# Altium schematic sheet Sheet1.SchDoc
size A4
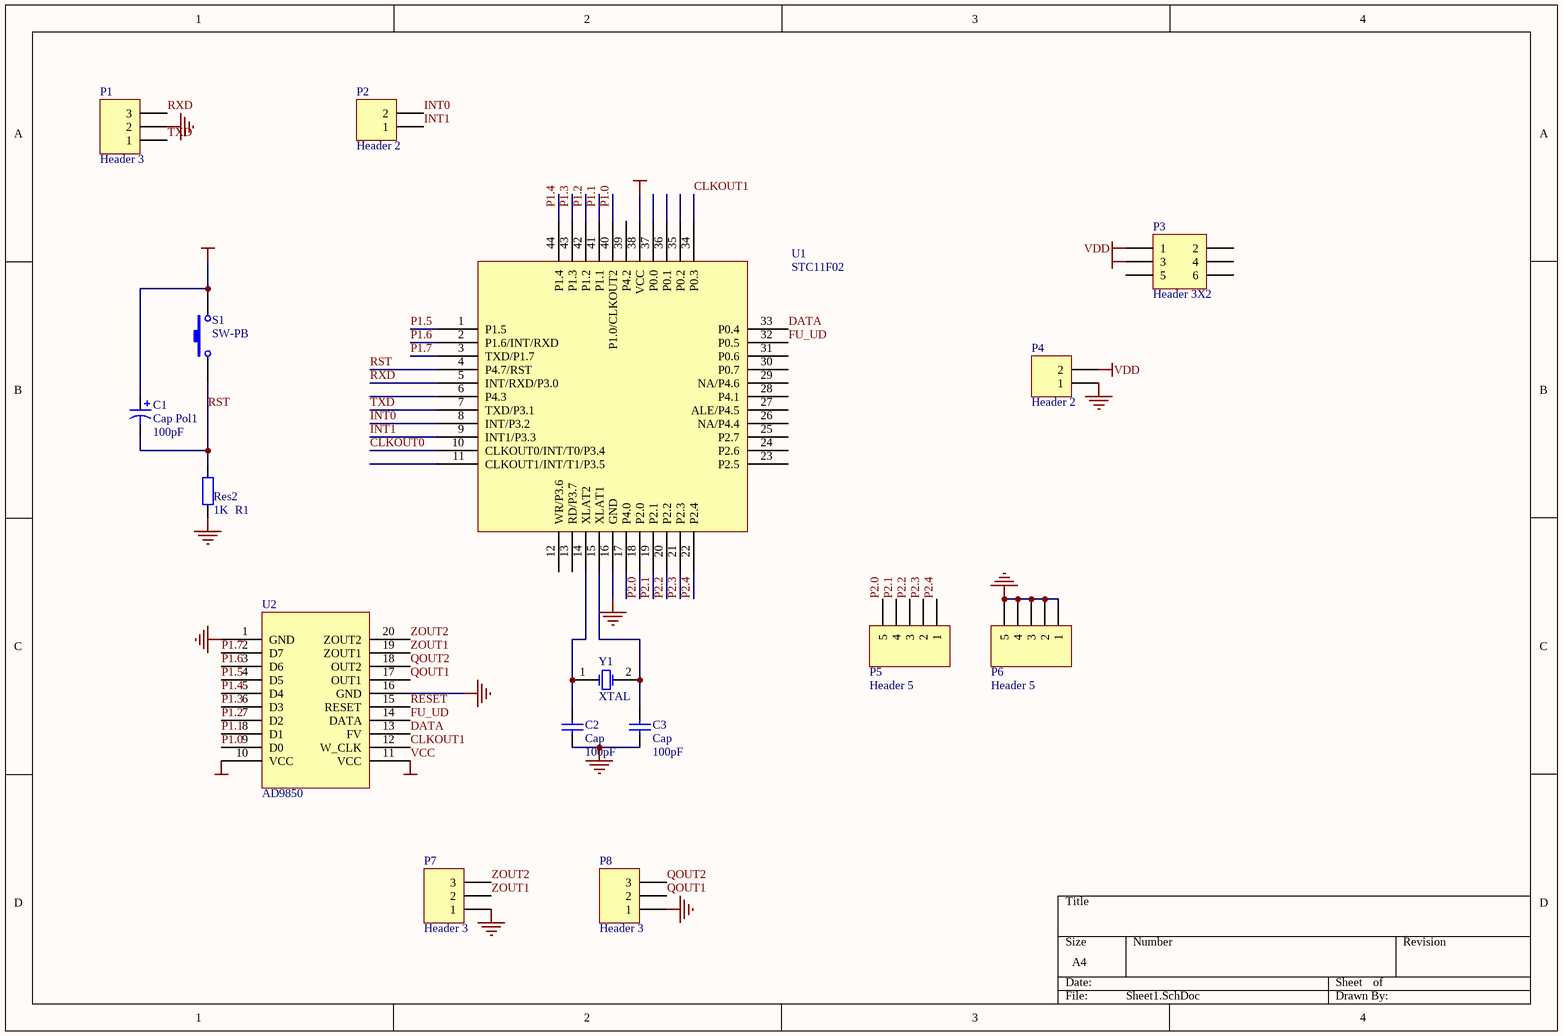
[diagram p0: Sheet1.SchDoc]

## Parts
C1  Cap Pol1  value 100pF  [3.5X2.8X1.9]
C2  Cap  value 100pF  [2012[0805]]
C3  Cap  value 100pF  [6-0805]
P1  Header 3  [HDR1X3]
P2  Header 2  [HDR1X2]
P3  Header 3X2  [KZ]
P4  Header 2  [HDR1X2]
P5  Header 5  [HDR1X5]
P6  Header 5  [HDR1X5]
P7  Header 3  [HDR1X3]
P8  Header 3  [HDR1X3]
R1  Res2  value 1K  [6-0805]
S1  SW-PB  [按键]
U1  STC11F02  [LQLPF44]
U2  AD9850  [ADMK]
Y1  XTAL  [XTAL-200mil]

## Nets
GND: C2.1 C3.1 P1.2 P4.1 P6.1 P6.2 P6.3 P6.4 P6.5 P7.1 P8.1 R1.1 U1.16(GND) U2.1(GND) U2.16(GND)
VCC: C1.1 P3.3 S1.2 U1.38(VCC) U2.10(VCC) U2.11(VCC)  [also labelled +5]
VDD: P3.1 P4.2
CLKOUT0: U1.10(CLKOUT0/INT/T0/P3.4)
CLKOUT1: U1.34(P0.3) U2.12(W_CLK)
DATA: U1.33(P0.4) U2.13(FV)
FU_UD: U1.32(P0.5) U2.14(DATA)
INT0: P2.2 U1.8(INT/P3.2)
INT1: P2.1 U1.9(INT1/P3.3)
P1.0: U1.40(P1.0/CLKOUT2) U2.9(D0)
P1.1: U1.41(P1.1) U2.8(D1)
P1.2: U1.42(P1.2) U2.7(D2)
P1.3: U1.43(P1.3) U2.6(D3)
P1.4: U1.44(P1.4) U2.5(D4)
P1.5: U1.1(P1.5) U2.4(D5)
P1.6: U1.2(P1.6/INT/RXD) U2.3(D6)
P1.7: U1.3(TXD/P1.7) U2.2(D7)
P2.0: P5.5 U1.18(P2.0)
P2.1: P5.4 U1.19(P2.1)
P2.2: P5.3 U1.20(P2.2)
P2.3: P5.2 U1.21(P2.3)
P2.4: P5.1 U1.22(P2.4)
QOUT1: P8.2 U2.17(OUT1)
QOUT2: P8.3 U2.18(OUT2)
RESET: U2.15(RESET)
RST: C1.2 R1.2 S1.1 U1.4(P4.7/RST)
RXD: P1.3 U1.5(INT/RXD/P3.0)
TXD: P1.1 U1.7(TXD/P3.1)
ZOUT1: P7.2 U2.19(ZOUT1)
ZOUT2: P7.3 U2.20(ZOUT2)
NetC2_2: C2.2 U1.14(XLAT2) Y1.1(OSC1)
NetC3_2: C3.2 U1.15(XLAT1) Y1.2(OSC2)

Not connected (* = marked no-connect by the designer): P3 2 4 5 6; U1 6(P4.3) 11(CLKOUT1/INT/T1/P3.5) 12(WR/P3.6) 13(RD/P3.7) 17(P4.0) 23(P2.5) 24(P2.6) 25(P2.7) 26(NA/P4.4) 27(ALE/P4.5) 28(P4.1) 29(NA/P4.6) 30(P0.7) 31(P0.6) 35(P0.2) 36(P0.1) 37(P0.0) 39(P4.2)

## Library data of the parts
C1 = Cap Pol1: Polarized Capacitor (Radial); Published: 8-Jun-2000; LatestRevisionDate: 17-Jul-2002; LatestRevisionNote: Re-released for DXP Platform.; PackageReference: RB7.6-15; Publisher: Altium Limited
C2 C3 = Cap: Capacitor; Published: 8-Jun-2000; LatestRevisionDate: 17-Jul-2002; LatestRevisionNote: Re-released for DXP Platform.; PackageReference: RAD-0.3; Publisher: Altium Limited
P1 P7 P8 = Header 3: Header, 3-Pin; LatestRevisionDate: 17-Jul-2002; LatestRevisionNote: Re-released for DXP Platform.; Publisher: Altium Limited
P2 P4 = Header 2: Header, 2-Pin; LatestRevisionDate: 17-Jul-2002; LatestRevisionNote: Re-released for DXP Platform.; Publisher: Altium Limited
P3 = Header 3X2: Header, 3-Pin, Dual row; LatestRevisionDate: 17-Jul-2002; LatestRevisionNote: Re-released for DXP Platform.; Publisher: Altium Limited
P5 P6 = Header 5: Header, 5-Pin; LatestRevisionDate: 17-Jul-2002; LatestRevisionNote: Re-released for DXP Platform.; Publisher: Altium Limited
R1 = Res2: Resistor; Published: 8-Jun-2000; LatestRevisionDate: 17-Jul-2002; LatestRevisionNote: Re-released for DXP Platform.; PackageReference: AXIAL-0.4; Publisher: Altium Limited
S1 = SW-PB: Switch; Published: 24-Mar-1999; LatestRevisionDate: 17-Jul-2002; LatestRevisionNote: Re-released for DXP Platform.; PackageReference: SPST-2; Publisher: Altium Limited
Y1 = XTAL: Crystal Oscillator; Published: 8-Jun-2000; LatestRevisionDate: 17-Jul-2002; LatestRevisionNote: Re-released for DXP Platform.; PackageReference: R38; Publisher: Altium Limited